# EAGLE design Tag-ECG-1V1 (EAGLE 9.6.2)

## Sheet 1 of 2
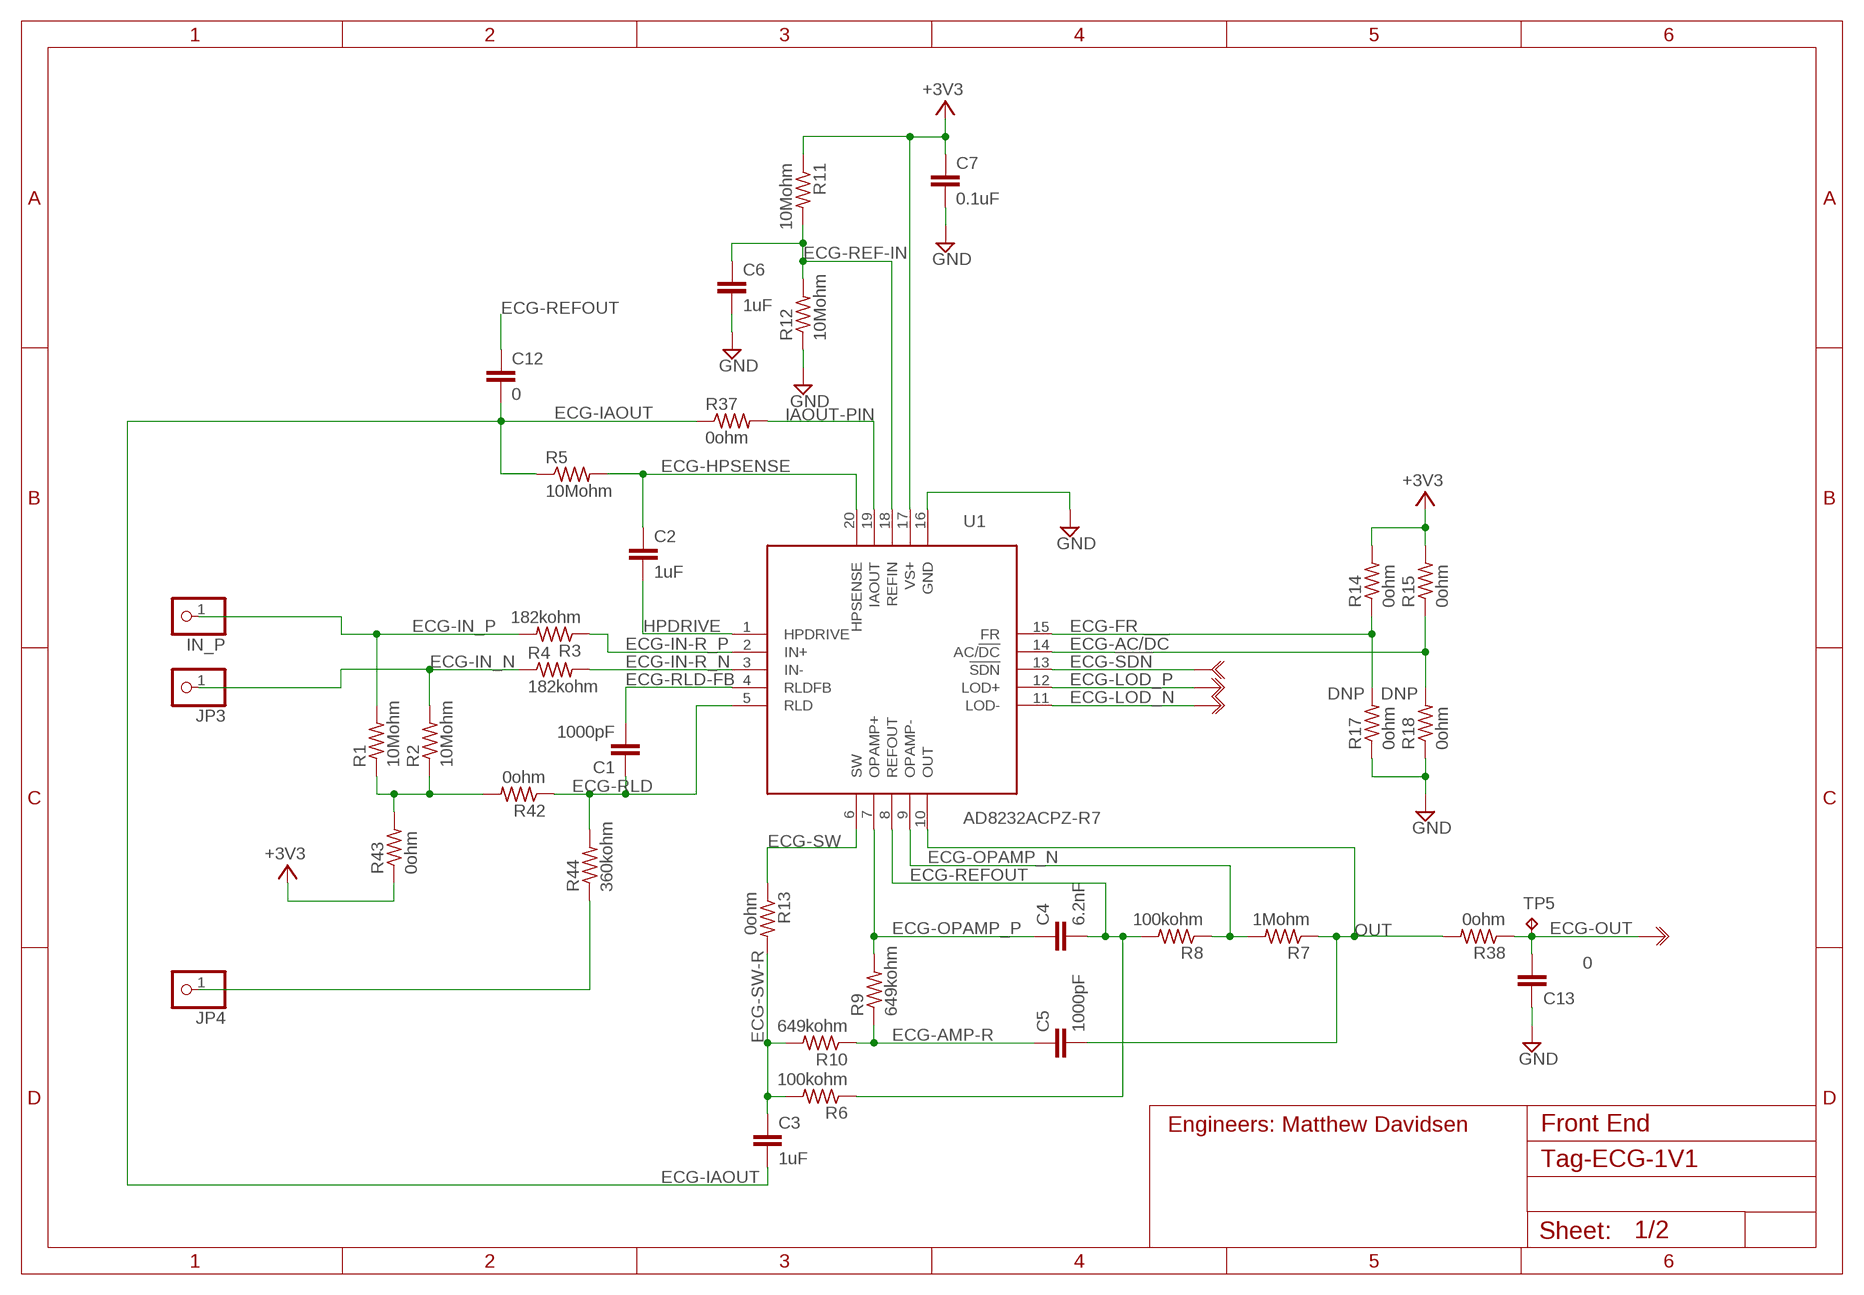
[diagram p0: schematic, sheet 1]
FRAME1 (A4L-LOC): NOTE: Engineers: Matthew Davidsen; SHEET_NAME: Front End

### Parts
C1  1000pF  CAP,CER,1000PF,2KV,10%,X7R,0402  [C0402]
C2  1uF  CAP,CER,1UF,10V,10%,X5R,0402  [C0402]
C3  1uF  CAP,CER,1UF,10V,10%,X5R,0402  [C0402]
C4  6.2nF  CAP,CER,6.2NF,25V,10%,X7R,0402  [C0402]
C5  1000pF  CAP,CER,1000PF,2KV,10%,X7R,0402  [C0402]
C6  1uF  CAP,CER,1UF,10V,10%,X5R,0402  [C0402]
C7  0.1uF  CAP,CER,0.1UF,16V,10%,X5R,0402  [C0402]
C12  0  CAP,CER,1UF,10V,10%,X5R,0402  [C0402]
C13  0  CAP,CER,1000PF,2KV,10%,X7R,0402  [C0402]
IN_P  PINHD-1X1  [1X01]
JP3  PINHD-1X1  [1X01]
JP4  PINHD-1X1  [1X01]
R1  10Mohm  RES,SMD,10MOHM,1%,1/10W,0402  [R0402]
R2  10Mohm  RES,SMD,10MOHM,1%,1/10W,0402  [R0402]
R3  182kohm  RES,SMD,182KOHM,1%,1/10W,0402  [R0402]
R4  182kohm  RES,SMD,182KOHM,1%,1/10W,0402  [R0402]
R5  10Mohm  RES,SMD,10MOHM,1%,1/10W,0402  [R0402]
R6  100kohm  RES,SMD,100KOHM,10%,1/10W,0402  [R0402]
R7  1Mohm  RES,SMD,1MOHM,1%,1/10W,0402  [R0402]
R8  100kohm  RES,SMD,100KOHM,10%,1/10W,0402  [R0402]
R9  649kohm  RES,SMD,649KOHM,1%,1/10W,0402  [R0402]
R10  649kohm  RES,SMD,649KOHM,1%,1/10W,0402  [R0402]
R11  10Mohm  RES,SMD,10MOHM,1%,1/10W,0402  [R0402]
R12  10Mohm  RES,SMD,10MOHM,1%,1/10W,0402  [R0402]
R13  0ohm  RES,SMD,1MOHM,1%,1/10W,0402  [R0402]
R14  0ohm  RES,SMD,0OHM,5%,1/16W,0402  [R0402]
R15  0ohm  RES,SMD,0OHM,5%,1/16W,0402  [R0402]
R17  0ohm  RES,SMD,0OHM,5%,1/16W,0402  [R0402]
R18  0ohm  RES,SMD,0OHM,5%,1/16W,0402  [R0402]
R37  0ohm  RES,SMD,10MOHM,1%,1/10W,0402  [R0402]
R38  0ohm  RES,SMD,1MOHM,1%,1/10W,0402  [R0402]
R42  0ohm  RES,SMD,0OHM,5%,1/16W,0402  [R0402]
R43  0ohm  RES,SMD,0OHM,5%,1/16W,0402  [R0402]
R44  360kohm  RES,SMD,0OHM,5%,1/16W,0402  [R0402]
TP5  TPB1,27  [B1,27]
U1  AD8232ACPZ-R7  [AD8232ACPZ-R7]
U$2  ON-PAGE  (no package)
U$5  OFF-PAGE  (no package)
U$6  OFF-PAGE  (no package)
U$39  OFF-PAGE  (no package)

### Nets
+3V3: C7.1 R11.1 R14.2 R15.2 R43.1 U1.17(VS+) ; also sheet 2
ECG-!SDN: U1.13(!SDN) U$2.IN ; also sheet 2
ECG-AC/!DC: R15.1 R18.2 U1.14(AC/!DC)
ECG-AMP-R: C5.1 R9.1 R10.1
ECG-FR: R14.1 R17.2 U1.15(FR)
ECG-HPSENSE: C2.1 R5.2 U1.20(HPSENSE)
ECG-IAOUT: C3.2 C12.2 R5.1 R37.1 ; also sheet 2
ECG-IN-R_N: R4.2 U1.3(IN-)
ECG-IN-R_P: R3.1 U1.2(IN+)
ECG-IN_N: JP3.1 R2.2 R4.1 ; also sheet 2
ECG-IN_P: IN_P.1 R1.2 R3.2 ; also sheet 2
ECG-LOD_N: U1.11(LOD-) U$39.OUT ; also sheet 2
ECG-LOD_P: U1.12(LOD+) U$6.OUT ; also sheet 2
ECG-OPAMP_N: R7.2 R8.1 U1.9(OPAMP-)
ECG-OPAMP_P: C4.1 R9.2 U1.7(OPAMP+)
ECG-OUT: C13.2 R38.1 TP5.TP U$5.OUT ; also sheet 2
ECG-REF-IN: C6.1 R11.2 R12.2 U1.18(REFIN)
ECG-REFOUT: C4.2 C12.1 R6.1 R8.2 U1.8(REFOUT)
ECG-RLD: C1.1 R42.1 R44.2 U1.5(RLD) ; also sheet 2
ECG-RLD-FB: C1.2 U1.4(RLDFB)
ECG-SW: R13.1 U1.6(SW)
ECG-SW-R: C3.1 R6.2 R10.2 R13.2
GND: C6.2 C7.2 C13.1 R12.1 R17.1 R18.1 U1.16(GND) ; also sheet 2
HPDRIVE: C2.2 U1.1(HPDRIVE)
IAOUT-PIN: R37.2 U1.19(IAOUT)
N$2: R1.1 R2.1 R42.2 R43.2
N$4: JP4.1 R44.1
OUT: C5.2 R7.1 R38.2 U1.10(OUT)

### Notes on the sheet
- DNP | DNP

## Sheet 2 of 2
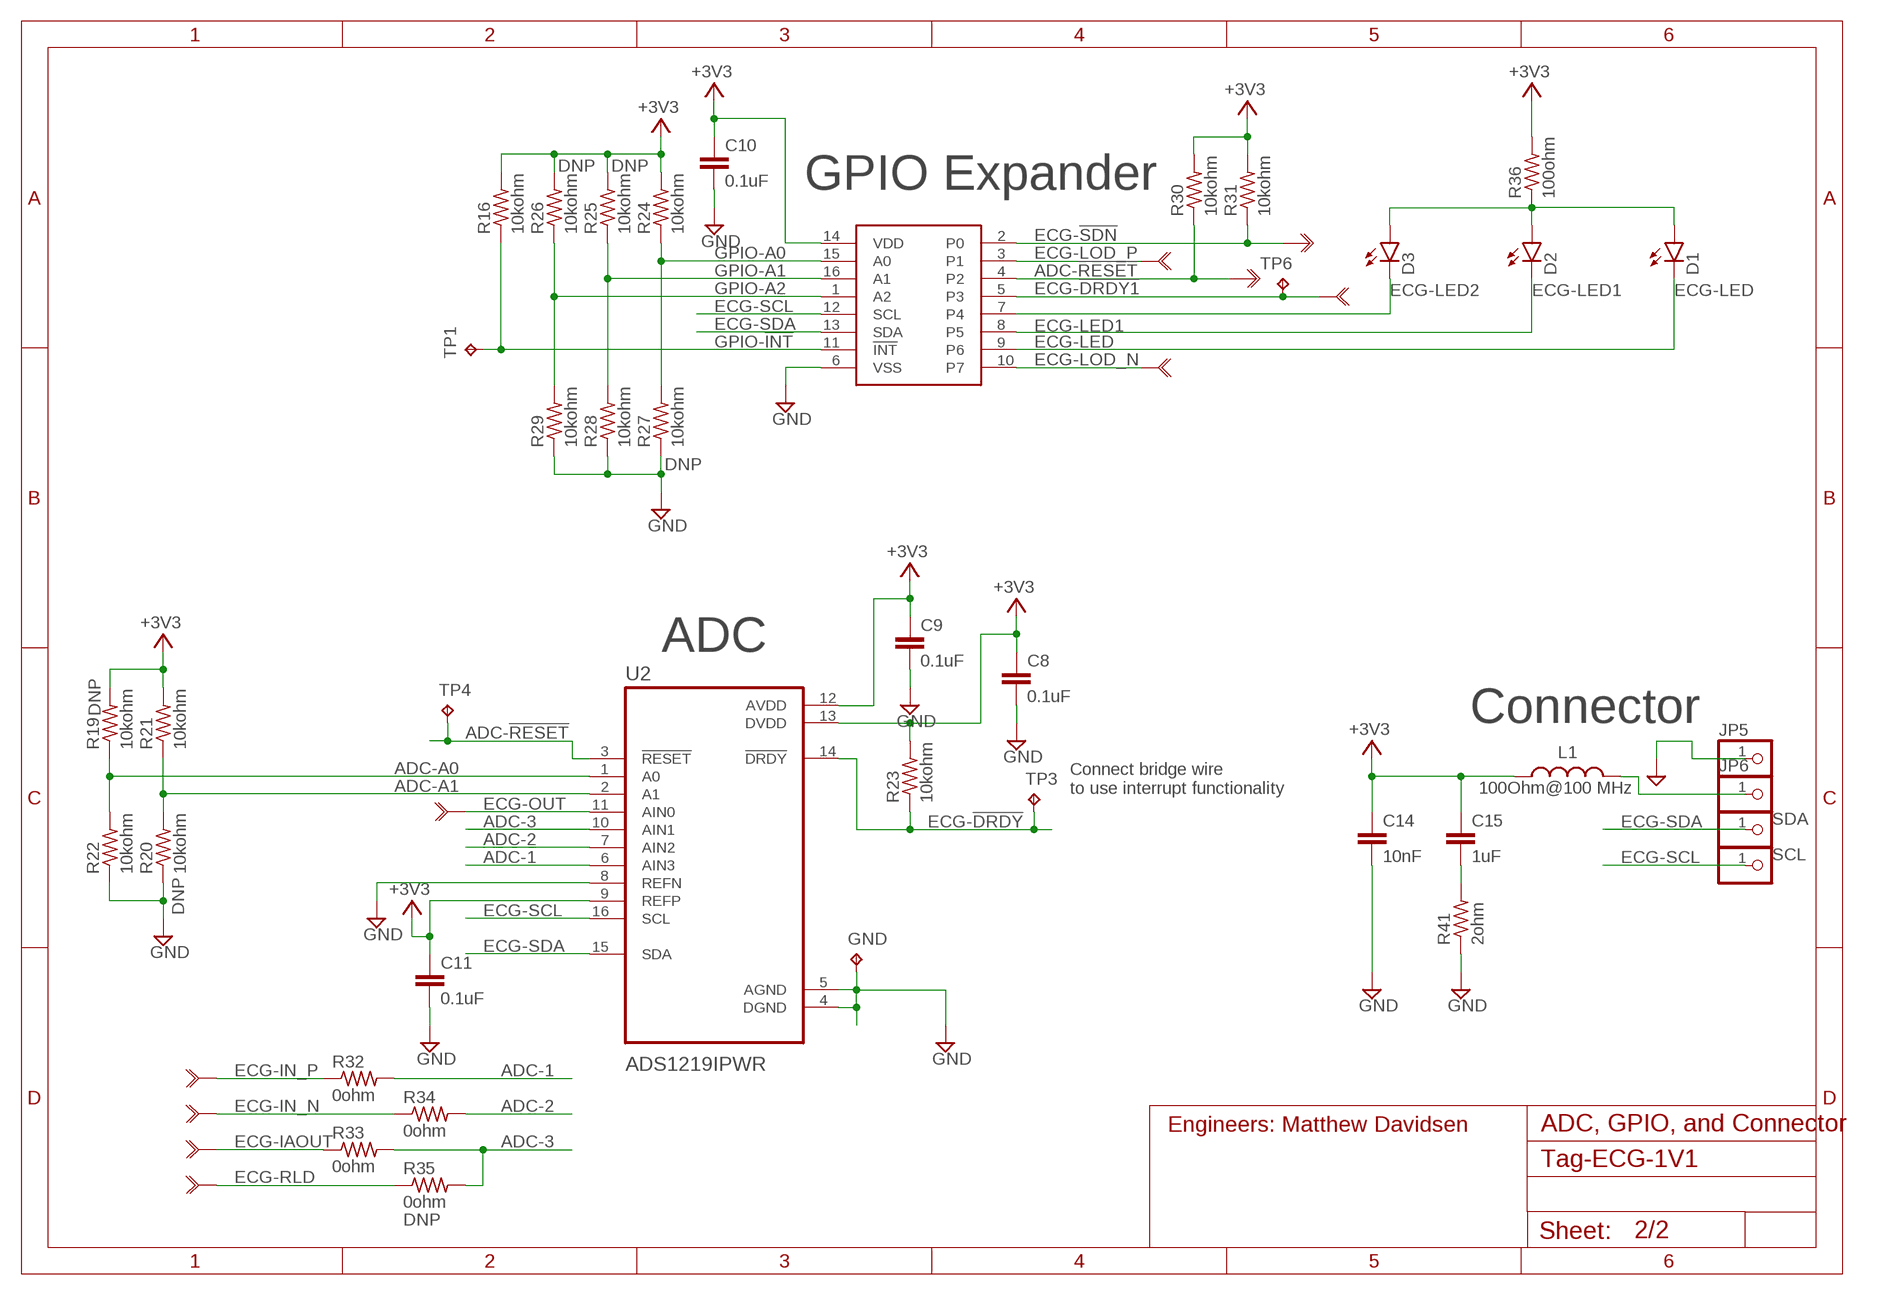
[diagram p1: schematic, sheet 2]
FRAME2 (A4L-LOC): NOTE: Engineers: Matthew Davidsen; SHEET_NAME: ADC, GPIO, and Connector

### Parts
C8  0.1uF  CAP,CER,0.1UF,16V,10%,X5R,0402  [C0402]
C9  0.1uF  CAP,CER,0.1UF,16V,10%,X5R,0402  [C0402]
C10  0.1uF  CAP,CER,0.1UF,16V,10%,X5R,0402  [C0402]
C11  0.1uF  CAP,CER,0.1UF,16V,10%,X5R,0402  [C0402]
C14  10nF  CAP,CER,0.1UF,16V,10%,X5R,0402  [C0402]
C15  1uF  CAP,CER,0.1UF,16V,10%,X5R,0402  [C0402]
D1  LED,SMD,GREEN,0603CHIP-LED0603  [CHIP-LED0603]
D2  LED,SMD,GREEN,0603CHIP-LED0603  [CHIP-LED0603]
D3  LED,SMD,GREEN,0603CHIP-LED0603  [CHIP-LED0603]
GND  TPB1,27  [B1,27]
JP5  PINHD-1X1  [1X01]
JP6  PINHD-1X1  [1X01]
L1  100Ohm@100 MHz  WE-CBF_0402_742792731_HC  [WE-CBF_0402_W2.2]
R16  10kohm  RES,SMD,10KOHM,1%,1/16W,0402  [R0402]
R19  10kohm  RES,SMD,10KOHM,1%,1/16W,0402  [R0402]
R20  10kohm  RES,SMD,10KOHM,1%,1/16W,0402  [R0402]
R21  10kohm  RES,SMD,10KOHM,1%,1/16W,0402  [R0402]
R22  10kohm  RES,SMD,10KOHM,1%,1/16W,0402  [R0402]
R23  10kohm  RES,SMD,10KOHM,1%,1/16W,0402  [R0402]
R24  10kohm  RES,SMD,10KOHM,1%,1/16W,0402  [R0402]
R25  10kohm  RES,SMD,10KOHM,1%,1/16W,0402  [R0402]
R26  10kohm  RES,SMD,10KOHM,1%,1/16W,0402  [R0402]
R27  10kohm  RES,SMD,10KOHM,1%,1/16W,0402  [R0402]
R28  10kohm  RES,SMD,10KOHM,1%,1/16W,0402  [R0402]
R29  10kohm  RES,SMD,10KOHM,1%,1/16W,0402  [R0402]
R30  10kohm  RES,SMD,10KOHM,1%,1/16W,0402  [R0402]
R31  10kohm  RES,SMD,10KOHM,1%,1/16W,0402  [R0402]
R32  0ohm  RES,SMD,0OHM,5%,1/16W,0402  [R0402]
R33  0ohm  RES,SMD,0OHM,5%,1/16W,0402  [R0402]
R34  0ohm  RES,SMD,0OHM,5%,1/16W,0402  [R0402]
R35  0ohm  RES,SMD,0OHM,5%,1/16W,0402  [R0402]
R36  100ohm  RES,SMD,100OHM,5%,1/10W,0402  [R0402]
R41  2ohm  RES,SMD,10KOHM,1%,1/16W,0402  [R0402]
SCL  PINHD-1X1  [1X01]
SDA  PINHD-1X1  [1X01]
TP1  TPB1,27  [B1,27]
TP3  TPB1,27  [B1,27]
TP4  TPB1,27  [B1,27]
TP6  TPB1,27  [B1,27]
U2  ADS1219IPWR  [SOP65P640X120-16N]
U3  PCA9674ABS  [QFN3X3-6]
U$3  ON-PAGE  (no package)
U$4  ON-PAGE  (no package)
U$21  ON-PAGE  (no package)
U$22  ON-PAGE  (no package)
U$23  OFF-PAGE  (no package)
U$24  ON-PAGE  (no package)
U$25  ON-PAGE  (no package)
U$35  OFF-PAGE  (no package)
U$36  ON-PAGE  (no package)
U$40  ON-PAGE  (no package)

### Nets
+3V3: C8.1 C9.1 C10.1 C11.1 C14.1 C15.1 L1.1 R16.2 R19.2 R21.2 R23.2 R24.2 R25.2 R26.2 R30.2 R31.2 R36.2 U2.9(REFP) U2.12(AVDD) U2.13(DVDD) U3.14(VDD) ; also sheet 1
ADC-1: R32.2 U2.6(AIN3)
ADC-2: R34.2 U2.7(AIN2)
ADC-3: R33.2 R35.2 U2.10(AIN1)
ADC-!RESET: R30.1 TP4.TP U2.3(!RESET) U3.4(P2) U$35.OUT
ADC-A0: R19.1 R22.2 U2.1(A0)
ADC-A1: R20.2 R21.1 U2.2(A1)
ECG-!DRDY: R23.1 TP3.TP U2.14(!DRDY)
ECG-!DRDY1: TP6.TP U3.5(P3) U$36.IN
ECG-!SDN: R31.1 U3.2(P0) U$23.OUT ; also sheet 1
ECG-IAOUT: R33.1 U$24.IN ; also sheet 1
ECG-IN_N: R34.1 U$25.IN ; also sheet 1
ECG-IN_P: R32.1 U$4.IN ; also sheet 1
ECG-LED: D1.C U3.9(P6)
ECG-LED1: D2.C U3.8(P5)
ECG-LED2: D3.C U3.7(P4)
ECG-LOD_N: U3.10(P7) U$40.IN ; also sheet 1
ECG-LOD_P: U3.3(P1) U$22.IN ; also sheet 1
ECG-OUT: U2.11(AIN0) U$21.IN ; also sheet 1
ECG-RLD: R35.1 U$3.IN ; also sheet 1
ECG-SCL: SCL.1 U2.16(SCL) U3.12(SCL)
ECG-SDA: SDA.1 U2.15(SDA) U3.13(SDA)
GND: C8.2 C9.2 C10.2 C11.2 C14.2 GND.TP JP5.1 R20.1 R22.1 R27.1 R28.1 R29.1 R41.1 U2.4(DGND) U2.5(AGND) U2.8(REFN) U3.6(VSS) ; also sheet 1
GPIO-!INT: R16.1 TP1.TP U3.11(!INT)
GPIO-A0: R24.1 R27.2 U3.15(A0)
GPIO-A1: R25.1 R28.2 U3.16(A1)
GPIO-A2: R26.1 R29.2 U3.1(A2)
N$1: JP6.1 L1.2
N$3: C15.2 R41.2
N$7: D1.A D2.A D3.A R36.1

### Notes on the sheet
- DNP | DNP
- GPIO Expander
- DNP
- ADC
- DNP
- Connector
- Connect bridge wire
  to use interrupt functionality
- DNP
- DNP

## Library data of the parts
C1 C5 = 0-Standard-Passives:CAP,CER,1000PF,2KV,10%,X7R,0402
C2 C3 C6 = 0-Standard-Passives:CAP,CER,1UF,10V,10%,X5R,0402
C4 = 0-Standard-Passives:CAP,CER,6.2NF,25V,10%,X7R,0402
C7-C11 = 0-Standard-Passives:CAP,CER,0.1UF,16V,10%,X5R,0402
C12 = 0-Standard-Passives:CAP,CER,1UF,10V,10%,X5R,0402; VALUE: 1uF
C13 = 0-Standard-Passives:CAP,CER,1000PF,2KV,10%,X7R,0402; VALUE: 1000pF
C14 C15 = 0-Standard-Passives:CAP,CER,0.1UF,16V,10%,X5R,0402; VALUE: 0.1uF
D1-D3 = 0-Custom-Opto:LED,SMD,GREEN,0603
GND TP1 TP3-TP6 = testpad:TP: Test pad
IN_P JP3-JP6 SCL SDA = pinhead:PINHD-1X1: PIN HEADER
L1 = Wurth_EMC Components_WE-CBF:WE-CBF_0402: WE-CBF SMD EMI Suppression Ferrite Bead Characteristics Reliable Ni-Sn electrodes High rated current up to 6 A Operating temperature: –55 ºC to +125 ºC Applications Perfect as data lined filter and for uncoupling of distribution voltage Package name and Variant abbreviation: Package: Wide Band /High Speed: W=Width= 1.5 High Current: W=Width= 2.2 Variant abbreviation: WB = Wide Band HS=High Speed HC=High Current <https://www.we-online.com/catalog/media/o14753v209%20Family_WE-CBF.jpg> Details see: www.we-online.com/katalog/WE-CBF <www.we-online.com/catalog/WE-CBF/?utm_source=eagle_model&utm_medium=description_link&utm_campaign=eisos_eagle> Updated by Ella Wu 2022-11-02 2022(C) Wurth Elektronik; DATASHEET-URL: https://www.we-online.com/redexpert/spec/742792731?ae; IR2: 1200mA; MOUNT: SMT; PART-NUMBER: 742792731; RDC-MAX: 0.09Ohm; TYPE: High Current; Z-MAX: 140Ohm@600 MHz
R1 R2 R5 R11 R12 = 0-Standard-Passives:RES,SMD,10MOHM,1%,1/10W,0402
R3 R4 = 0-Standard-Passives:RES,SMD,182KOHM,1%,1/10W,0402
R6 R8 = 0-Standard-Passives:RES,SMD,100KOHM,10%,1/10W,0402
R7 = 0-Standard-Passives:RES,SMD,1MOHM,1%,1/10W,0402
R9 R10 = 0-Standard-Passives:RES,SMD,649KOHM,1%,1/10W,0402
R13 R38 = 0-Standard-Passives:RES,SMD,1MOHM,1%,1/10W,0402; VALUE: 1Mohm
R14 R15 R17 R18 R32-R35 R42 R43 = 0-Standard-Passives:RES,SMD,0OHM,5%,1/16W,0402
R16 R19-R31 = 0-Standard-Passives:RES,SMD,10KOHM,1%,1/16W,0402
R36 = 0-Standard-Passives:RES,SMD,100OHM,5%,1/10W,0402
R37 = 0-Standard-Passives:RES,SMD,10MOHM,1%,1/10W,0402; VALUE: 10Mohm
R41 = 0-Standard-Passives:RES,SMD,10KOHM,1%,1/16W,0402; VALUE: 10kohm
R44 = 0-Standard-Passives:RES,SMD,0OHM,5%,1/16W,0402; VALUE: 0ohm
U1 = AD8232ACPZ-R7:AD8232ACPZ-R7
U2 = ADS1219IPWR:ADS1219IPWR; DESCRIPTION: 24-bit, 1kSPS, 4-ch general-purpose delta-sigma ADC with I2C interface and external Vref inputs; DIGI-KEY_PART_NUMBER: 296-50884-2-ND; MF: Texas Instruments; MP: ADS1219IPWR; PACKAGE: TSSOP-16 Texas Instruments; PURCHASE-URL: https://pricing.snapeda.com/search/part/ADS1219IPWR/?ref=eda
U3 = untitled:PCA9674ABS
U$2-U$4 U$21 U$22 U$24 U$25 U$36 U$40 = 0-Custom-Markers:ON-PAGE
U$5 U$6 U$23 U$35 U$39 = 0-Custom-Markers:OFF-PAGE

## Board
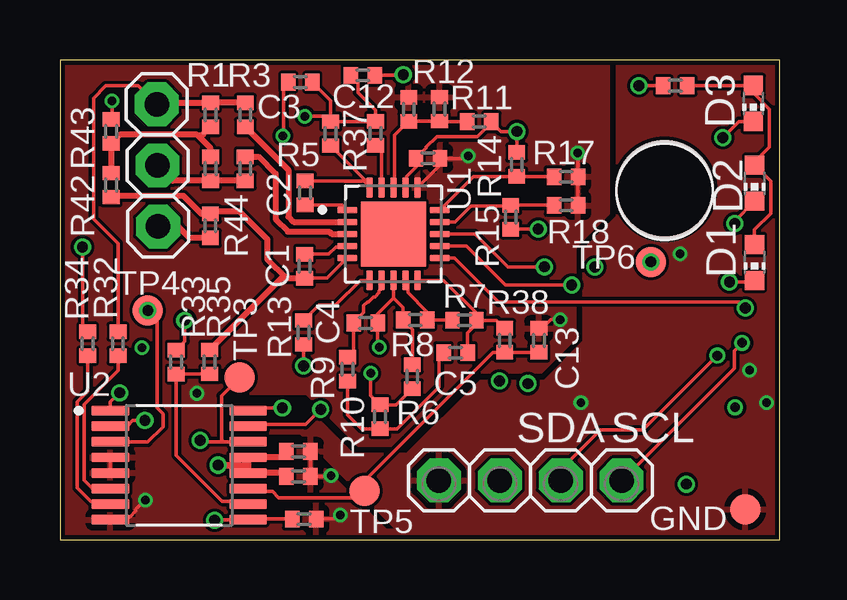
[diagram p2: board, top side]
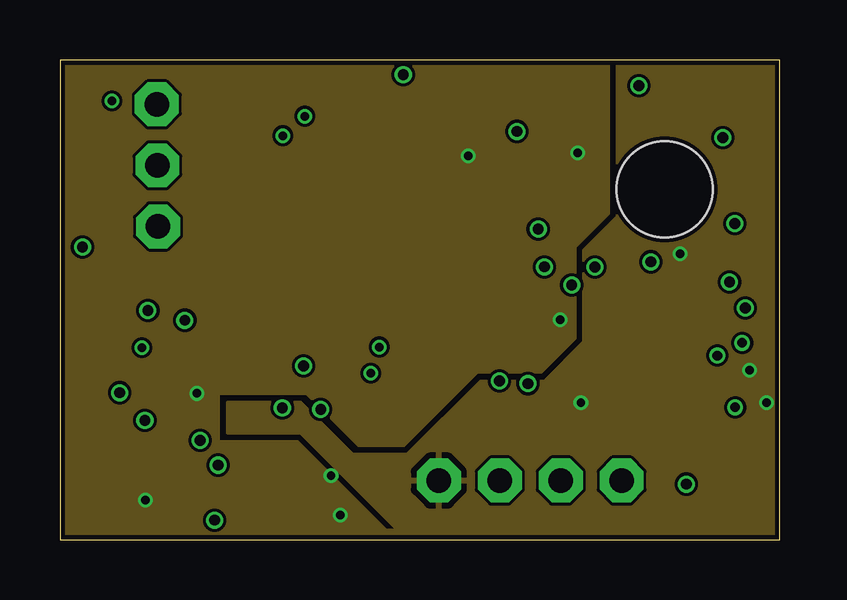
[diagram p3: board, inner layer Route2]
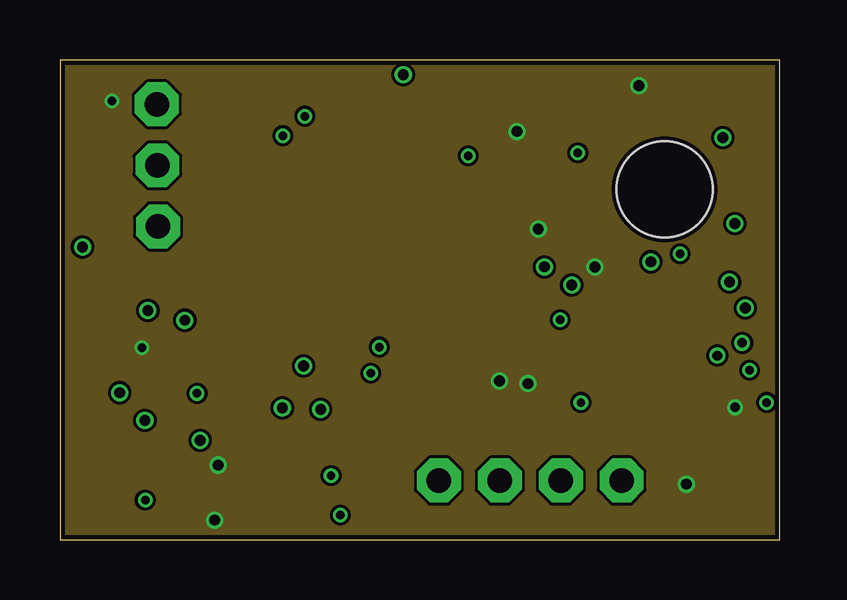
[diagram p4: board, inner layer Route15]
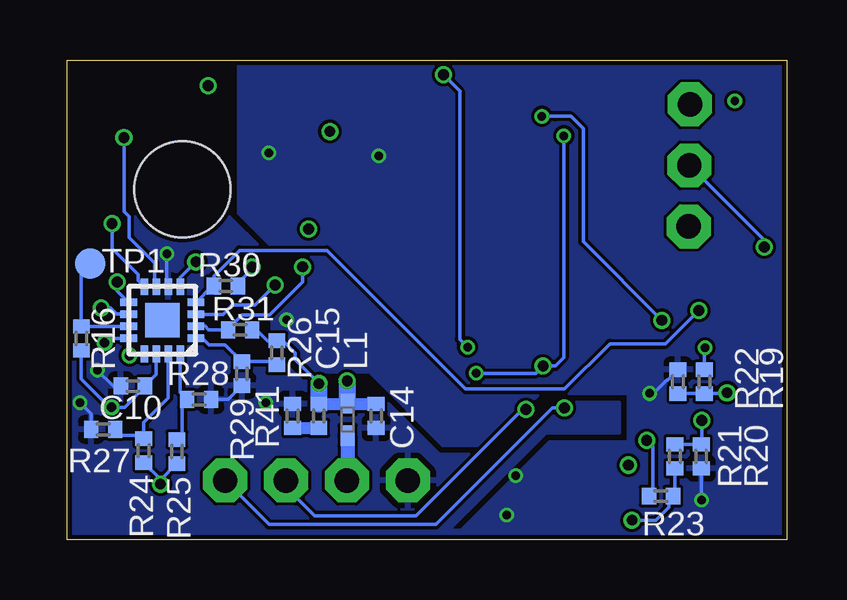
[diagram p5: board, bottom side, seen from below]

Size 30 x 20 mm. Coordinates in mm from the lower left corner, seen from the top.
Outline: 0,0 30,0 30,20 0,20 0,0
Copper layers (1+2*15+16): Top 0.035mm / dielectric 0.2mm / Route2 0.0175mm / dielectric 1.065mm / Route15 0.0175mm / dielectric 0.2mm / Bottom 0.035mm
Design rules "default *": minimum track width 3.5mil, minimum drill 0.3mm, track to track 5mil, track to pad 0.2mm, pad to pad 5mil, via to via 0.5mm, smd to smd 5mil, copper to edge 0.2mm, drill to drill 6mil, minimum pad ring 10mil, minimum via ring 0.13mm, stop-mask expansion 0.05mm, vias tented up to drill 20mil, thermal gap 10mil
Holes 4 mm at 25.2,14.6

### Footprints (pad centres in the part's own frame; a part is rotated, then mirrored left to right if it is on the bottom)
C0402 = smd 0.6 x 0.7: 1 -0.5,0; 2 0.5,0
CHIP-LED0603 = smd 0.8 x 0.8: A 0,-0.75; C 0,0.75
B1,27 = smd 1.27 x 1.27: TP 0,0
1X01 = drill 1.016 octagon: 1 0,0
WE-CBF_0402_W2.2 = smd 0.85 x 0.6: 1 -0.675,0; 2 0.675,0
R0402 = smd 0.6 x 0.7: 1 -0.5,0; 2 0.5,0
AD8232ACPZ-R7 = smd 0.84 x 0.26: 1 -1.935,1; 2 -1.935,0.5; 3 -1.935,0; 4 -1.935,-0.5; 5 -1.935,-1; 11 1.935,-1; 12 1.935,-0.5; 13 1.935,0; 14 1.935,0.5; 15 1.935,1 | smd 0.26 x 0.84: 6 -1,-1.935; 7 -0.5,-1.935; 8 0,-1.935; 9 0.5,-1.935; 10 1,-1.935; 16 1,1.935; 17 0.5,1.935; 18 0,1.935; 19 -0.5,1.935; 20 -1,1.935 | smd 2.7 x 2.7: 21 0,0
SOP65P640X120-16N = smd 1.57 x 0.41: 1 -2.87,2.275; 2 -2.87,1.625; 3 -2.87,0.975; 4 -2.87,0.325; 5 -2.87,-0.325; 6 -2.87,-0.975; 7 -2.87,-1.625; 8 -2.87,-2.275; 9 2.87,-2.275; 10 2.87,-1.625; 11 2.87,-0.975; 12 2.87,-0.325; 13 2.87,0.325; 14 2.87,0.975; 15 2.87,1.625; 16 2.87,2.275
QFN3X3-6 = smd 0.7 x 0.3: 1 -1.4,0.75; 2 -1.4,0.25; 3 -1.4,-0.25; 4 -1.4,-0.75; 9 1.4,-0.75; 10 1.4,-0.25; 11 1.4,0.25; 12 1.4,0.75 | smd 0.3 x 0.7: 5 -0.75,-1.4; 6 -0.25,-1.4; 7 0.25,-1.4; 8 0.75,-1.4; 13 0.75,1.4; 14 0.25,1.4; 15 -0.25,1.4; 16 -0.75,1.4 | smd 1.45 x 1.45: EXP 0,0

### Placement (x,y rotation side)
C1  10.2,11.4 90 top
C2  10.22,14.46 270 top
C3  10.02,19.07 0 top
C4  12.74,9.04 0 top
C5  16.49,7.79 0 top
C6  14.54,17.94 90 top
C7  15.34,15.89 0 top
C8  9.94,2.64 0 top
C9  9.94,3.67 0 top
C10  27.26,6.4 180 bottom
C11  10.18,0.86 0 top
C12  12.62,19.35 180 top
C13  19.96,8.31 270 top
C14  17.12,5.16 270 bottom
C15  19.51,5.16 270 bottom
D1  28.96,11.56 180 top
D2  28.96,14.86 180 top
D3  28.91,18.19 180 top
GND  28.57,1.27 0 top
IN_P  4.04,18.15 0 top
JP3  4.06,15.61 0 top
JP4  4.09,13.06 0 top
JP5  15.8,2.46 0 top
JP6  18.34,2.46 0 top
L1  18.31,5 270 bottom
R1  6.28,17.71 90 top
R2  6.28,15.46 270 top
R3  7.73,17.71 90 top
R4  7.72,15.46 90 top
R5  11.29,16.93 270 top
R6  14.69,6.8 270 top
R7  16.86,9.14 180 top
R8  14.81,9.15 180 top
R9  11.99,7.1 90 top
R10  13.34,5.12 90 top
R11  17.48,17.43 180 top
R12  15.82,17.95 270 top
R13  10.16,8.64 270 top
R14  19.04,15.64 90 top
R15  18.79,13.44 270 top
R16  29.41,8.39 270 bottom
R17  21.1,15.13 180 top
R18  21.1,13.93 180 top
R19  3.44,6.58 90 bottom
R20  3.57,3.47 90 bottom
R21  4.67,3.47 270 bottom
R22  4.54,6.58 270 bottom
R23  5.25,1.81 0 bottom
R24  26.81,3.71 270 bottom
R25  25.43,3.67 270 bottom
R26  21.26,7.79 90 bottom
R27  28.5,4.59 0 bottom
R28  24.5,5.84 180 bottom
R29  22.72,6.92 90 bottom
R30  23.38,10.57 0 bottom
R31  22.79,8.75 0 bottom
R32  2.42,8.17 270 top
R33  4.84,7.4 270 top
R34  1.16,8.17 270 top
R35  6.24,7.4 270 top
R36  25.65,18.92 180 top
R37  13.16,16.94 270 top
R38  18.54,8.31 90 top
R41  20.6,5.16 270 bottom
R42  2.13,14.78 90 top
R43  2.13,17.02 270 top
R44  6.27,13.08 90 top
SCL  23.42,2.46 0 top
SDA  20.88,2.46 0 top
TP1  29.03,11.5 180 bottom
TP3  7.5,6.76 0 top
TP4  3.67,9.56 180 top
TP5  12.7,2.03 0 top
TP6  24.64,11.58 0 top
U1  13.91,12.74 0 top
U2  4.97,3.1 0 top
U3  26.04,9.14 180 bottom

### Tracks (layer width: path | path; a pad name or v marks a point on that pad's centre or on a via)
+3V3  (via drill 0.35, 0.4, 0.45)
  Top 0.152: U1.17 14.45,14.72 14.45,15.14 14.84,15.54 C7.1 15.27,16.32 15.27,16.36 15.71,16.8 17.4,16.8 17.92,17.32 18.09,17.32 | v6.45,0.81 6.47,0.83 U2.9 7.87,0.86 C11.1 | R36.2 v24.13,18.92 | R14.2 v19.04,17.01 v19.05,17.02 18.39,17.02 18.09,17.32 | R11.1 18.09,17.32 | R15.2 v19.93,12.95 v19.94,12.95 | R43.1 2.17,17.55 v2.17,18.29
  Top 0.254: C8.1 9.31,2.78 U2.12 | C9.1 9.2,3.43 U2.13 | U2.13 U2.12 | U2.12 7.51,3.1 v6.6,3.1 7.64,3.1 7.84,3.3 U2.13
  Bottom 0.152: U3.14 26.29,6.88 C10.1 26.76,6.36 27.6,5.52 v28.14,5.52 v28.15,5.51 28.23,5.51 29.41,6.7 R16.2 | L1.1 | 18.04,5.66 18.19,5.81 L1.1 | R31.2 22.1,8.74 21.64,8.29 R26.2 21.01,8.29 20.51,7.79 20.51,7.5 v19.51,6.5 | v6.45,0.81 5.45,0.81 4.92,1.34 4.92,1.64 R23.2 4.67,1.89 R21.2 | R30.2 22.88,10.7 22.3,11.28 v22.3,11.37 | 18.31,6.6 v18.33,6.62 | R24.2 26.11,2.51 v26.11,2.31 26.11,2.49 R25.2 | 18.35,5.66 L1.1 | R19.2 3.44,7.97 v3.41,8
  Bottom 0.508: 18.04,5.66 C14.1 | C15.1 18.35,5.66
  Bottom 0.711: C15.1 v19.51,6.5 | L1.1 18.31,6.6
  pour Route15: 0,20 0,-0.13 30,-0.13 30,20
ADC-1
  Top 0.152: U2.6 1.34,2.13 1,2.46 1,5.63 2.42,7.05 R32.2
ADC-2
  Top 0.152: R34.2 1.16,6.18 0.72,5.75 0.72,2.15 1.28,1.6 1.98,1.6 U2.7
ADC-3
  Top 0.152: U2.10 7.72,1.6 6.77,1.6 4.84,3.52 R33.2 R35.2
ADC-!RESET  (via drill 0.45)
  Top 0.152: TP4.TP 4.05,9.18 4.05,5.49 4.3,5.23 4.3,4.71 3.66,4.06 2.11,4.06 U2.3
  Bottom 0.152: U3.4 23.96,10.57 R30.1 23.88,10.99 22.82,12.06 19.17,12.06 13.39,6.27 9.27,6.27 7.38,8.16 5.06,8.16 TP4.TP
  other vias: 3.67,9.56
ADC-A0  (via drill 0.45)
  Top 0.152: v2.49,6.12 2.1,5.73 U2.1
  Bottom 0.152: R22.2 R19.1 2.53,6.08 v2.49,6.12
ADC-A1  (via drill 0.45)
  Top 0.152: U2.2 2.14,4.77 2.84,4.77 3.04,4.97 v3.54,4.97
  Bottom 0.152: R21.1 R20.2 3.54,4 v3.54,4.97
ECG-!DRDY  (via drill 0.45)
  Top 0.152: v5.84,4.14 5.9,4.08 U2.14 6.82,4.08 6.73,4.17 6.73,6 TP3.TP
  Bottom 0.152: v5.84,4.14 5.59,3.89 5.59,1.97 R23.1
ECG-!DRDY1  (via drill 0.45)
  Bottom 0.152: U3.5 25.29,10.94 TP6.TP
  other vias: 24.64,11.58
ECG-!SDN  (via drill 0.45)
  Top 0.152: v20.19,11.37 18.67,11.37 17.3,12.74 U1.13
  Bottom 0.152: U3.2 24.25,8.9 24.1,8.74 R31.1 23.29,8.79 22.71,9.37 21.56,9.37 20.19,10.74 v20.19,11.37
ECG-AC/!DC
  Top 0.152: U1.14 16.47,13.24 17.14,13.91 18.76,13.91 R15.1 20.59,13.95 R18.2
ECG-AMP-R
  Top 0.152: R9.1 11.99,5.21 12.57,4.62 R10.1 14.05,4.62 15.8,6.37 15.8,7.59 C5.1
ECG-FR
  Top 0.152: U1.15 17.24,15.14 R14.1 19.06,15.13 R17.2
ECG-HPSENSE
  Top 0.152: R5.2 12.91,14.81 12.91,14.73 | 12.91,14.73 U1.20 | C2.1 12.68,14.96 12.91,14.73
ECG-IAOUT  (via drill 0.35, 0.45)
  Top 0.152: R5.1 11.29,18.31 C3.2 | C12.2 12.42,19.06 12.42,18.64 13.16,17.9 R37.1 13.14,17.43 R5.1 | R33.1 5.21,8.27 v5.21,9.14 | v10.21,17.65 11.06,17.65 R5.1
  Bottom 0.152: v5.21,9.14 8.48,12.42 8.48,17.13 9.01,17.65 9.66,17.65 | 9.66,17.65 | 9.66,17.65 v10.21,17.65
ECG-IN-R_N
  Top 0.254: U1.3 11.33,12.74 11.23,12.84 9.5,12.84 8.99,13.35 8.99,15.25 8.27,15.96 R4.2
ECG-IN-R_P
  Top 0.254: R3.1 9.53,15.41 9.53,13.46 9.74,13.24 U1.2
ECG-IN_N  (via drill 0.45)
  Top 0.152: v0.94,12.19 0.94,8.89 R34.1 | R2.2
  Top 0.254: JP3.1 4.71,14.96 R2.2 R4.1
  Bottom 0.152: v0.94,12.19 0.94,12.48 JP3.1
ECG-IN_P
  Top 0.152: R32.1 2.42,12.35 1.4,13.37 1.4,18.41 1.91,18.92 3.27,18.92 IN_P.1
  Top 0.254: IN_P.1 4.09,18.21 R1.2 R3.2
ECG-LED  (via drill 0.45)
  Top 0.152: D1.C 28.89,10.74 v27.91,10.74
  Bottom 0.152: U3.9 27.91,10.37 v27.91,10.74
ECG-LED1  (via drill 0.45)
  Top 0.152: D2.C 28.14,13.29 v28.14,13.18
  Bottom 0.152: U3.8 27.05,10.81 27.05,11.06 28.14,12.14 v28.14,13.18
ECG-LED2  (via drill 0.45)
  Top 0.152: v27.64,16.76 28.31,17.44 D3.C
  Bottom 0.152: U3.7 26.36,10.62 26.36,11.52 27.42,12.59 27.42,13.47 27.64,13.68 v27.64,16.76
ECG-LOD_N  (via drill 0.45)
  Top 0.152: v28.57,9.65 28.32,9.91 18.29,9.91 16.45,11.74 U1.11
  Bottom 0.152: U3.10 27.94,9.4 28.19,9.65 v28.57,9.65
ECG-LOD_P  (via drill 0.45)
  Top 0.152: U1.12 16.94,12.24 18.57,10.62 v21.34,10.62
  Bottom 0.152: U3.3 23.5,9.39 23.12,9.78 22.17,9.78 v21.34,10.62
ECG-OPAMP_N
  Top 0.152: U1.9 14.5,10.71 14.5,10.29 15.31,9.48 R8.1 16.36,9.15 R7.2
ECG-OPAMP_P
  Top 0.152: R9.2 12.24,7.86 C4.1 12.67,9.46 12.67,9.75 12.83,9.91 12.87,9.91 13.06,10.11 13.13,10.11 13.31,10.29 13.31,10.36 13.41,10.45 U1.7
ECG-OUT
  Top 0.152: U2.11 7.97,2 8.86,2 9.11,1.75 12.41,1.75 TP5.TP 12.7,2.45 18.06,7.81 R38.1 C13.2
ECG-REF-IN
  Top 0.152: R11.2 15.84,17.43 R12.2 C6.1 13.96,16.86 13.96,14.73 U1.18
ECG-REFOUT  (via drill 0.35, 0.45)
  Top 0.152: 13.91,10.08 13.24,9.42 C4.2 13.24,8.09 v13.31,8.03 | 13.91,10.08 U1.8 | 13.91,10.08 14.31,9.68 R8.2 14.69,8.77 R6.1 | v14.31,19.38 14.29,19.36 C12.1
  Bottom 0.152: v13.31,8.03 13.63,8.34 13.63,18.69 v14.31,19.38
ECG-RLD
  Top 0.152: 5.9,13.58 R44.2 6.38,13.69 | R42.1 2.18,14.33 | U1.5 11.13,10.9 C1.1 9.42,10.9
  Top 0.254: 5.9,13.58 5.16,14.33 2.18,14.33 | 6.38,13.69 7.47,13.69 8.64,12.52 8.64,11.68 9.42,10.9 | R35.1 9.24,10.9 C1.1
ECG-RLD-FB
  Top 0.152: U1.4 11.93,12.2 11.51,12.2 11.21,11.9 C1.2
ECG-SCL  (via drill 0.4, 0.45)
  Top 0.152: v28.44,8.2 28.11,7.87 28.11,7.13 23.44,2.46 SCL.1 | U2.16 7.95,5.49 v9.27,5.49
  Bottom 0.152: U3.12 28.25,8.39 v28.44,8.2 | SCL.1 21.59,0.64 14.63,0.64 9.78,5.49 v9.27,5.49
ECG-SDA  (via drill 0.4, 0.45)
  Top 0.152: v27.41,7.67 24.31,4.57 22.53,4.57 20.88,2.92 SDA.1 | v10.87,5.43 10.24,4.79 7.9,4.79 U2.15
  Bottom 0.152: U3.13 27.33,7.74 v27.41,7.67 | v10.87,5.43 11.02,5.43 15.46,0.99 19.69,0.99 20.88,2.17 SDA.1
ECG-SW
  Top 0.152: U1.6 12.53,10.81 11.5,9.78 10.8,9.78 R13.1
ECG-SW-R  (via drill 0.35, 0.45)
  Top 0.152: R13.2 v10.16,7.24 | v9.3,16.84 9.32,16.86 9.32,18.87 C3.1 | v12.95,6.93 12.95,6.01 R10.2 14.01,5.62 R6.2
  Bottom 0.152: v9.3,16.84 9.3,7.59 9.65,7.24 v10.16,7.24 10.46,6.93 v12.95,6.93
GND  (via drill 0.35)
  Top 0.152: U2.4 U2.5 | U2.8 2.22,0.95 2.92,0.95 3.16,1.19 3.16,1.26 v3.56,1.65 | C11.2 11.53,0.86 v11.68,1.02 | C9.2 C8.2 11.28,2.64 v11.3,2.67 | U1.16 15.84,15.62 C7.2 16.91,15.89 v17.02,16 | R18.1 R17.1 v21.6,16.12 v21.59,16.13 | C13.1 20.11,8.81 20.47,9.17 v20.85,9.17
  Bottom 0.152: v29.46,5.71 29,5.25 R27.1 | v3.56,1.65 3.57,1.66 R20.1 | R22.1 4.97,6.66 5.01,6.66 5.57,6.1 v5.71,6.1 | R28.1 23.29,5.84 R29.1 | v25.85,11.91 25.85,10.61 U3.6 | C10.2 28.08,6.4 v28.75,7.06
  other vias: 21.72,5.71
  pour Route2: 14.1,0.38 10.03,4.45 6.99,4.45 6.99,5.71 10.03,5.71 12.19,3.56 14.48,3.56 17.53,6.6 20.19,6.6 21.84,8.26 21.84,12.06 23.24,13.46 23.24,19.94 29.97,19.94 29.97,0 0,0 0,19.94 22.86,19.94 22.86,13.59 21.46,12.19 21.46,8.38 20.07,6.99 17.4,6.99 14.35,3.94 12.45,3.94 10.29,6.1 6.6,6.1 6.6,4.06 9.91,4.06 13.59,0.38
  pour Top: 14.1,0.38 10.03,4.45 6.99,4.45 6.99,5.71 10.03,5.71 12.19,3.56 14.48,3.56 17.53,6.6 20.19,6.6 21.84,8.26 21.84,12.06 23.24,13.46 23.24,19.94 29.97,19.94 29.97,0 0,0 0,19.94 22.86,19.94 22.86,13.59 21.46,12.19 21.46,8.38 20.07,6.99 17.4,6.99 14.35,3.94 12.45,3.94 10.29,6.1 6.6,6.1 6.6,4.06 9.91,4.06 13.59,0.38
  pour Bottom: 14.1,0.38 10.03,4.45 6.99,4.45 6.99,5.71 10.03,5.71 12.19,3.56 14.48,3.56 17.53,6.6 20.19,6.6 21.84,8.26 21.84,12.06 23.24,13.46 23.24,19.94 29.97,19.94 29.97,0 0,0 0,19.94 22.86,19.94 22.86,13.59 21.46,12.19 21.46,8.38 20.07,6.99 17.4,6.99 14.35,3.94 12.45,3.94 10.29,6.1 6.6,6.1 6.6,4.06 9.91,4.06 13.59,0.38
GPIO-!INT
  Bottom 0.152: U3.11 R16.1 29.41,11.13 TP1.TP
GPIO-A0
  Bottom 0.152: U3.15 25.79,5.91 26.81,4.89 R24.1 26.94,4.33 27.74,4.33 R27.2
GPIO-A1
  Bottom 0.152: U3.16 25.29,6.12 R28.2 25.2,5.64 25.2,4.4 R25.1
GPIO-A2
  Bottom 0.152: U3.1 24.36,8.39 24.09,8.12 23.42,8.12 R29.2 21.39,7.42 R26.1
HPDRIVE
  Top 0.152: C2.2 11.76,13.96 U1.1
IAOUT-PIN
  Top 0.152: R37.2 13.41,16.19 U1.19
N$1
  Bottom 0.584: L1.2 18.31,2.49 JP6.1
N$2
  Top 0.152: 5.97,16.9 2.52,16.9 R43.2
  Top 0.254: R42.2 R43.2 2.49,16.88 5.72,16.88 6.28,16.32 R2.1 | 5.97,16.9 R1.1
N$3
  Bottom 0.508: R41.2 C15.2
N$4
  Top 0.254: R44.1 5.4,12.58 4.93,13.06 JP4.1
N$7
  Top 0.152: D2.A | D1.A 28.96,12.92 29.63,13.6 29.63,14.95 D2.A | D2.A 28.9,15.68 29.58,16.36 29.58,17.95 28.91,18.63 D3.A 28.89,18.92 R36.1
OUT
  Top 0.152: R7.1 17.36,9.44 15.99,10.81 U1.10 | R7.1 17.53,9.14 16.99,8.61 C5.2 | R7.1 18.2,9.14 R38.2